# Altium project braslet_pcb.PrjPcb
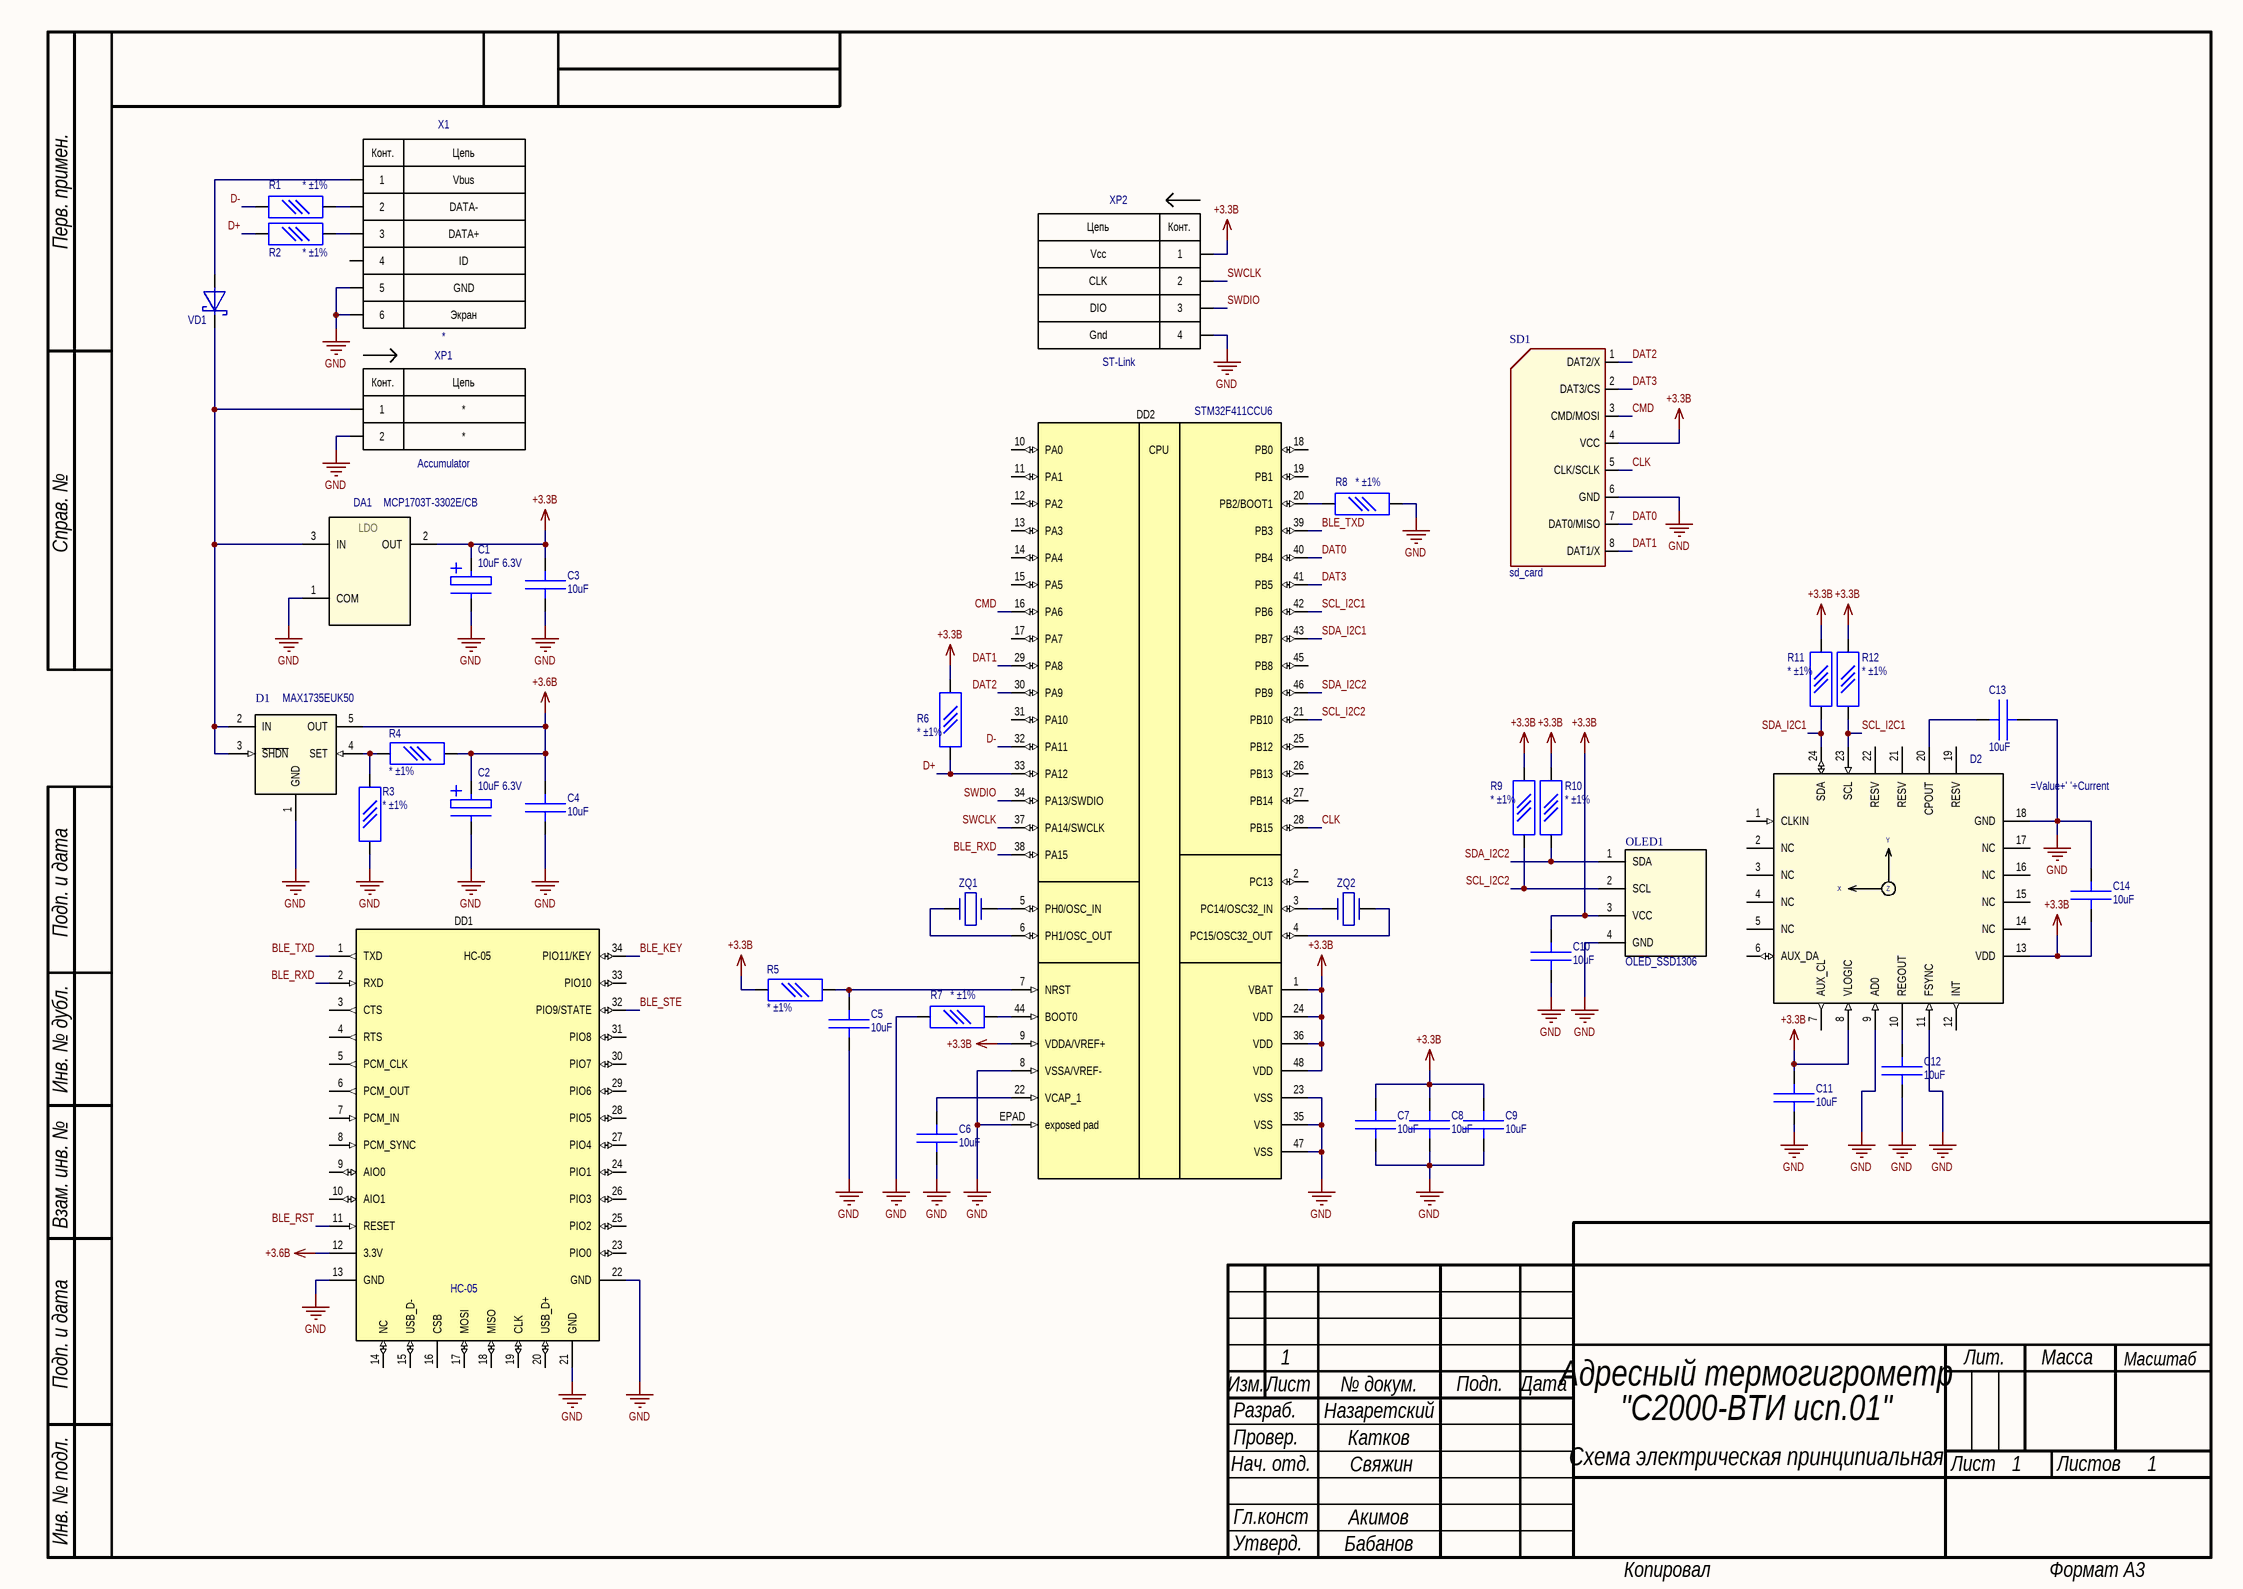
[diagram p0: braslet_pcb.SchDoc]
DecimalNumber: ОКР АЦДР.413614.002.ЭЗ; IzmNum: 6
1 sheet, 39 parts. Net scope: global (net labels, ports and power ports of the same name join across sheets).
Board file: braslet_pcb.PcbDoc

## Sheet braslet_pcb.SchDoc
size 420 x 297 mm; ApprovedBy: Бабанов; CheckedBy: Катков; DrawnBy: Назаретский; DocumentNumber: ОКР АЦДР.413614.002.ЭЗ; SheetNumber: 1; SheetTotal: 1; Title1str: Адресный термогигрометр; PageSetup: Record=PageOptions|CenterHorizontal=False|CenterVertical=False|PrintScale=0.67|XCorrection=0.00|YCorrection=0.00|PrintKind=2|BorderSize=5000000|LeftOffset=0|BottomOffset=0|Orientation=2|PaperLength=1000|PaperWidth=1000|Scale=100|PaperSource=15|PrintQuality=600|MediaType=1|DitherType=10|PrintScaleMode=1|PaperKind=A4|PaperIndex=9; Title2str: "С2000-ВТИ исп.01"; ProcessInspection: Свяжин; NormInspection: Акимов; DocumentType2str: Схема электрическая принципиальная; ChangeNumber: 6; ChangeSheet: 1

### Parts
C1  10uF 6.3V  [TANT_3.2X1.6_A]
C2  10uF 6.3V  [TANT_3.2X1.6_A]
C3  10uF  [CC0603_0.8mm]
C4  10uF  [CC0603_0.8mm]
C5  10uF  [CC0603_0.8mm]
C6  10uF  [CC0603_0.8mm]
C7  10uF  [CC0603_0.8mm]
C8  10uF  [CC0603_0.8mm]
C9  10uF  [CC0603_0.8mm]
C10  10uF  [CC0603_0.8mm]
C11  10uF  [CC0603_0.8mm]
C12  10uF  [CC0603_0.8mm]
C13  10uF  [CC0603_0.8mm]
C14  10uF  [CC0603_0.8mm]
D1  MAX1735EUK50  [SOT-23-5]
D2  (no value)  [QFN24_4X4mm]
DA1  MCP1703T-3302E/CB  [SOT-23A_MCP]
DD1  HC-05  [HC-05]
DD2  STM32F411CCU6  [UFQFPN48_7x7_STM]
OLED1  OLED_SSD1306  [oled_128x32]
R1  * ±1%  [R0603]
R2  * ±1%  [R0603]
R3  * ±1%  [R0603]
R4  * ±1%  [R0603]
R5  * ±1%  [R0603]
R6  * ±1%  [R0603]
R7  * ±1%  [R0603]
R8  * ±1%  [R0603]
R9  * ±1%  [R0603]
R10  * ±1%  [R0603]
R11  * ±1%  [R0603]
R12  * ±1%  [R0603]
SD1  sd_card  [sd_conn]
VD1  MBR0530T3G.1G  [SOD-123]  (value not drawn)
X1  *  Circuit_1: Vbus  Circuit_2: DATA-  Circuit_3: DATA+  Circuit_4: GND  Circuit_5: ID  [MICRO-USB-B (629105136821)]
XP1  Accumulator  [Conn_01x02]
XP2  ST-Link  Circuit_1: Vcc  Circuit_2: CLK  Circuit_3: DIO  Circuit_4: Gnd  [B4B-ZR]
ZQ1  (no value)  [NX3225GD]
ZQ2  (no value)  [NX3225GD]

### Nets
+3.3B: C1.2(+) C3.1 C7.1 C8.1 C9.1 C10.1 C11.1 C14.2 D2.8(VLOGIC) D2.13(VDD) DA1.2(OUT) DD2.1(VBAT) DD2.9(VDDA/VREF+) DD2.24(VDD) DD2.36(VDD) DD2.48(VDD) OLED1.3(VCC) R5.2(TOP) R6.2(TOP) R9.2(TOP) R10.2(TOP) R11.2(TOP) R12.2(TOP) SD1.4(VCC) XP2.1
+3.6B: C2.2(+) C4.1 D1.5(OUT) DD1.12(3.3V) R4.2(TOP)
GND: C1.1(-) C2.1(-) C3.2 C4.2 C5.2 C6.2 C7.2 C8.2 C9.2 C10.2 C11.2 C12.2 C13.2 C14.1 D1.1(GND) D2.9(AD0) D2.11(FSYNC) D2.18(GND) DA1.1(COM) DD1.13(GND) DD1.21(GND) DD1.22(GND) DD2.8(VSSA/VREF-) DD2.23(VSS) DD2.35(VSS) DD2.47(VSS) DD2.EPAD(exposed_pad) OLED1.4(GND) R3.1(BOT) R7.2(TOP) R8.1(BOT) SD1.6(GND) X1.5 X1.Shield(6) XP1.2 XP2.4
BLE_KEY: DD1.34(PIO11/KEY)
BLE_RST: DD1.11(RESET)
BLE_RXD: DD1.2(RXD) DD2.38(PA15)
BLE_STE: DD1.32(PIO9/STATE)
BLE_TXD: DD1.1(TXD) DD2.39(PB3)
CLK: DD2.28(PB15) SD1.5(CLK/SCLK)
CMD: DD2.16(PA6) SD1.3(CMD/MOSI)
D+: DD2.33(PA12) R2.1(BOT) R6.1(BOT)
D-: DD2.32(PA11) R1.1(BOT)
DAT0: DD2.40(PB4) SD1.7(DAT0/MISO)
DAT1: DD2.29(PA8) SD1.8(DAT1/X)
DAT2: DD2.30(PA9) SD1.1(DAT2/X)
DAT3: DD2.41(PB5) SD1.2(DAT3/CS)
SCL_I2C1: D2.23(SCL) DD2.42(PB6) R12.1(BOT)
SCL_I2C2: DD2.21(PB10) OLED1.2(SCL) R9.1(BOT)
SDA_I2C1: D2.24(SDA) DD2.43(PB7) R11.1(BOT)
SDA_I2C2: DD2.46(PB9) OLED1.1(SDA) R10.1(BOT)
SWCLK: DD2.37(PA14/SWCLK) XP2.2
SWDIO: DD2.34(PA13/SWDIO) XP2.3
NetC5_1: C5.1 DD2.7(NRST) R5.1(BOT)
NetC6_1: C6.1 DD2.22(VCAP_1)
NetC12_1: C12.1 D2.10(REGOUT)
NetC13_1: C13.1 D2.20(CPOUT)
NetD1_2: D1.2(IN) D1.3(~{SHDN}) DA1.3(IN) VD1.1(C) XP1.1
NetD1_4: D1.4(SET) R3.2(TOP) R4.1(BOT)
NetDD2_3: DD2.3(PC14/OSC32_IN) ZQ2.1
NetDD2_4: DD2.4(PC15/OSC32_OUT) ZQ2.2
NetDD2_5: DD2.5(PH0/OSC_IN) ZQ1.2
NetDD2_6: DD2.6(PH1/OSC_OUT) ZQ1.1
NetDD2_20: DD2.20(PB2/BOOT1) R8.2(TOP)
NetDD2_44: DD2.44(BOOT0) R7.1(BOT)
NetR1_2: R1.2(TOP) X1.2
NetR2_2: R2.2(TOP) X1.3
NetVD1_2: VD1.2(A) X1.1

Not connected (* = marked no-connect by the designer): D2 1(CLKIN) 2(NC) 3(NC) 4(NC) 5(NC) 6(AUX_DA) 7(AUX_CL) 12(INT) 14(NC) 15(NC) 16(NC) 17(NC) 19(RESV) 21(RESV) 22(RESV); DD1 3(CTS) 4(RTS) 5(PCM_CLK) 6(PCM_OUT) 7(PCM_IN) 8(PCM_SYNC) 9(AIO0) 10(AIO1) 14(NC) 15(USB_D-) 16(CSB) 17(MOSI) 18(MISO) 19(CLK) 20(USB_D+) 23(PIO0) 24(PIO1) 25(PIO2) 26(PIO3) 27(PIO4) 28(PIO5) 29(PIO6) 30(PIO7) 31(PIO8) 33(PIO10); DD2 2(PC13) 10(PA0) 11(PA1) 12(PA2) 13(PA3) 14(PA4) 15(PA5) 17(PA7) 18(PB0) 19(PB1) 25(PB12) 26(PB13) 27(PB14) 31(PA10) 45(PB8); X1 4

### Notes on the sheet
- Перв. примен.
- Справ. №
- Подп. и дата
- Инв. № дубл.
- Взам. инв. №
- Изм.
- Лист
- № докум.
- Подп.
- Дата
- Лит.
- Масса
- Масштаб
- Нач. отд.
- Провер.
- Разраб.
- Листов
- Инв. № подл.
- Гл.конст
- Утверд.
- Копировал
- Формат А3
- (in symbol ADXL327) Y; X; Z
- (in symbol B4B-ZR_conn_01x04_st_link) Цепь; Конт.
- (in symbol Conn_01x02) Конт.; Цепь
- (in symbol STM32F411CCU6) CPU
- (in symbol USB_5pin) Конт.; Цепь; Экран

### Library data of the parts
C1 C2 = 3216-10uF-10%-6,3V: Конденсатор SMD CC 3216-10uF-10%-6,3V (Case A)  Vishay (AVX); DeveloperMnemocod: CTS_3216_10uF_10%_6.3V; Developer_ID: 220960157; ComponentVersion: 0; Type: CC3216; Tolerance: ±10%; Part Number: 3216-10uF-10%-6,3V; Name: 3216-10uF-10%-6,3V; Creator: Турнаев С.С.; PatternVersion: 0; ComponentLink1Description: Manufacturer; ComponentLink2Description: Datasheet; ComponentLink2URL: \\192.168.11.60\BolidLibrary\Altium\Database\Datasheets\354380256.pdf; ComponentLink3Description: Datasheet 2; ComponentLink3URL: \\192.168.11.60\BolidLibrary\Altium\Database\Datasheets\1135595732.pdf; ComponentLink4Description: Datasheet 3; Value: 10uF; Voltage: 6.3V
C3-C14 = C0603_X5R_10uF_20%_6.3V: Конденсатор SMD CC 0603-X5R-10uF-20%-6,3V CL10A106MQ8NNNC SAMSUNG; Developer_ID: 590958101; ComponentVersion: 0; PatternVersion: 1; Type: X5R; Voltage: 6.3V; Tolerance: 20%; Part Number: C0603_X5R_10uF_20%_6.3V; Name: C0603_X5R_10uF_20%_6.3V; DeveloperMnemocod: C0603_X5R_10uF_20%_6.3V; ComponentLink1Description: Manufacturer; ComponentLink2Description: Datasheet; ComponentLink2URL: \\192.168.11.60\BolidLibrary\Altium\Database\Datasheets\817977306.pdf; ComponentLink3Description: Datasheet 2; ComponentLink4Description: Datasheet 3; Value: 10uF
D1 = MAX1735EUK50: Type: LDO; ComponentLink1Description: New link; ComponentLink1URL: https://www.chipdip.ru/product/max1735euk50-t; Name: MAX1735EUK50
D2 = ADXL327: Type: Accelerometr; Name: ADXL327; Link1: https://www.chipdip.ru/product/mp1410es
DA1 = MCP1703T-3302E/CB: Value: 3.3V; Name: MCP1703T-3302E/CB; Link1: https://www.chipdip.ru/product/mcp1703t-3302e-cb-3; Type: LDO
DD1 = HC-05: Bluetooth module; Name: HC-05; Link1: *; Type: Module
DD2 = STM32F411CCU6: ARM-based 32-bit MCU; Name: STM32F411CCU6; Link1: *; Type: Микроконтроллер
R1-R12 = Res_0603: Name: R0603; Value: *; Type: Резистор SMD; Tolerance: ±1%; Link1: *
VD1 = MBR0530T3G.1G: Диод Шоттки SMD MBR0530T3G.1G; Manufacturer: Fairchild; Developer_ID: 590971401; DeveloperRecomend: Желательно; ComponentVersion: 0; Value: 500mA; Vr: 30V; Part Number: MBR0530T3G.1G; Name: MBR0530T3G.1G; DeveloperMnemocod: MBR0530T3G.1G; Creator: Турнаев С.С.; PatternVersion: 0; ComponentLink1Description: Manufacturer; ComponentLink1URL: http://www.fairchildsemi.com; ComponentLink2Description: Datasheet; ComponentLink2URL: \\192.168.11.60\BolidLibrary\Altium\Database\Datasheets\592176212.pdf; ComponentLink3Description: Datasheet 2; ComponentLink3URL: \\192.168.11.60\BolidLibrary\Altium\Database\Datasheets\592176653.pdf; ComponentLink4Description: Datasheet 3; ComponentLink4URL: \\192.168.11.60\BolidLibrary\Altium\Database\Datasheets\592177087.pdf; Type: Schottky; If: 500mA
X1 = USB_5pin: Name: *; Type: *; Link1: *
XP1 = Conn_01x02: Name: B4B-ZR; Link1: https://www.chipdip.ru/product/b4b-zr; Link2: *; Link3: *; Type: Разъём; Circuit_1: *; Circuit_2: *
XP2 = B4B-ZR_conn_01x04_st_link: Name: B4B-ZR; Link1: https://www.chipdip.ru/product/b4b-zr; Link2: *; Link3: *; Type: Разъём
ZQ1 ZQ2 = NX3225GD-8MHz STD: Резонатор кварцевый SMD NX3225GD-8MHz STD-CRA-3; Developer_ID: 1088713184; ComponentVersion: 0; TempRange: -40.. +150; Part Number: NX3225GD-8MHz STD; Name: NX3225GD-8MHz STD; DeveloperMnemocod: NX3225GD-8MHz STD; Creator: Назаретский С.А.; ComponentHeight: 1mm; PatternVersion: 0; ComponentLink1Description: Manufacturer; ComponentLink2Description: Datasheet; ComponentLink2URL: \\192.168.11.60\BolidLibrary\Altium\Database\Datasheets\1263733697.pdf; ComponentLink3Description: Datasheet 2; ComponentLink4Description: Datasheet 3; Type: Quartz SMD